# EAGLE design ICP_XMega (EAGLE 6.6.0)
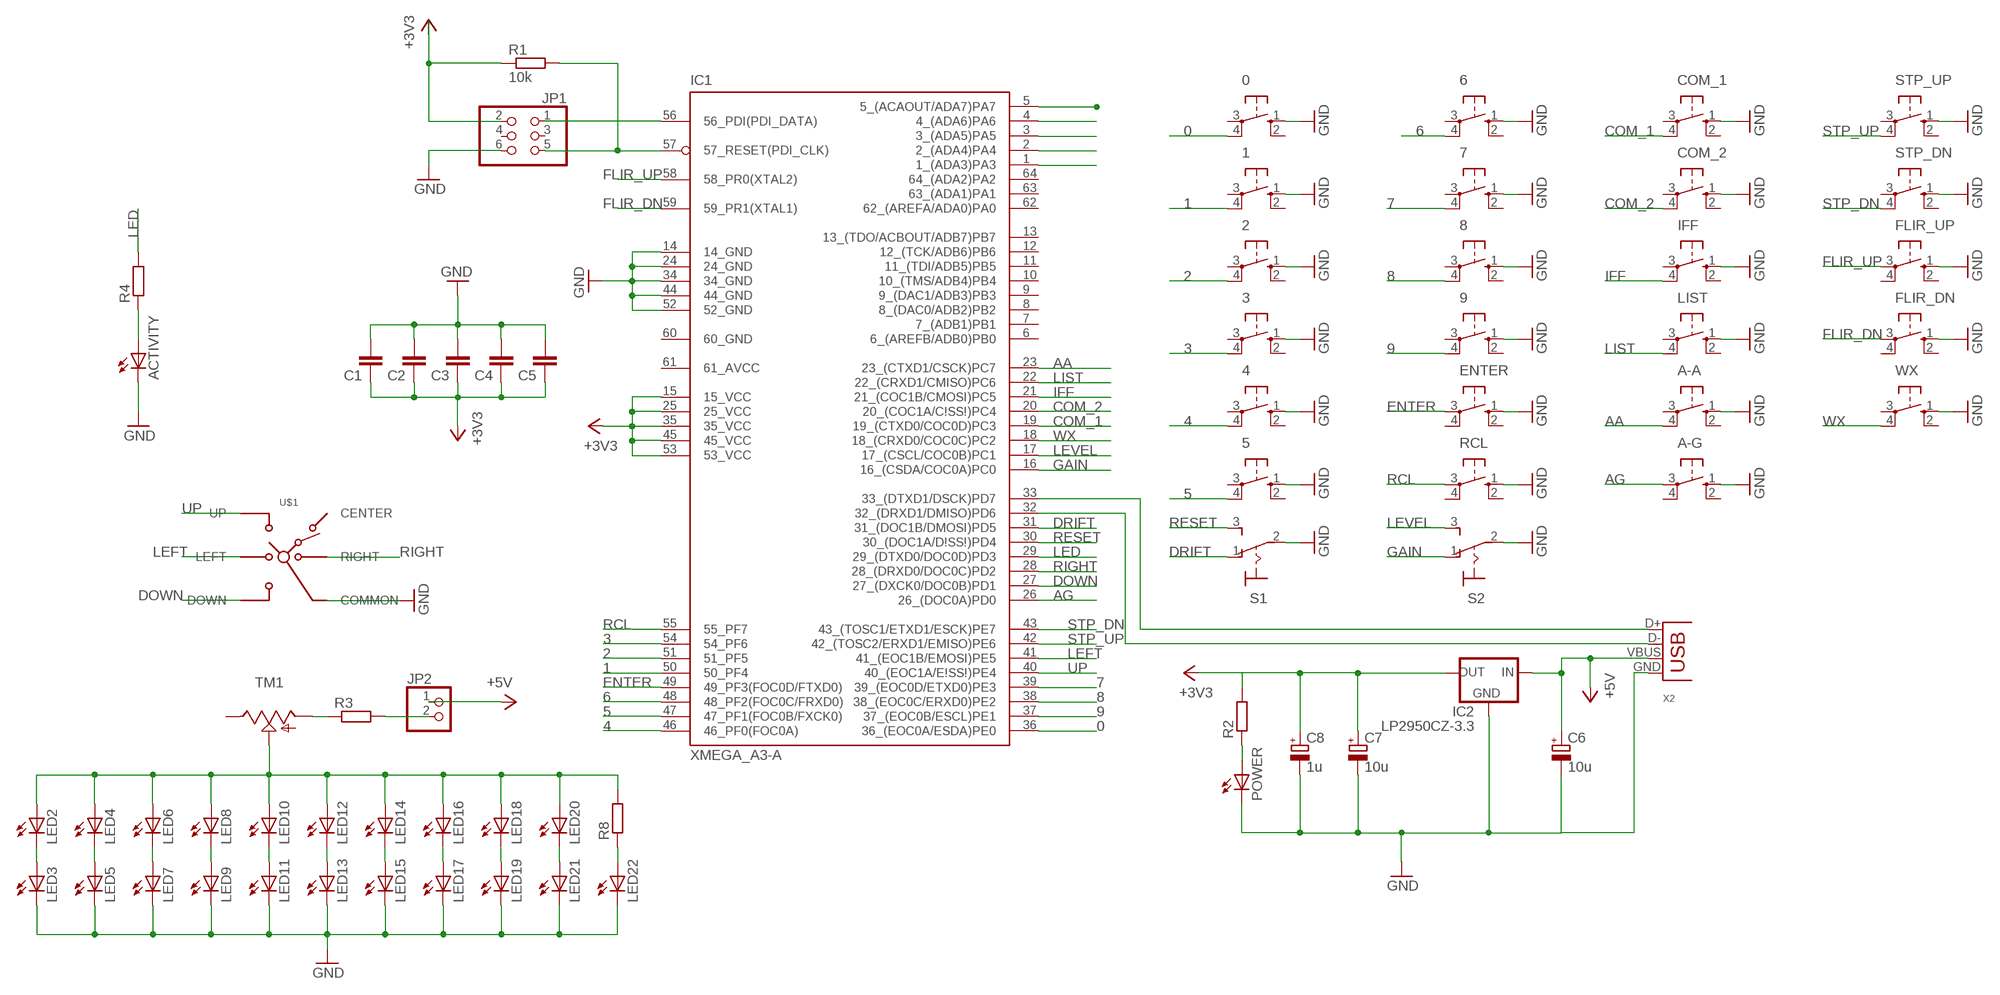
[diagram p0: schematic, sheet 1]

## Parts
0  10-XX  [B3F-10XX]
1  10-XX  [B3F-10XX]
2  10-XX  [B3F-10XX]
3  10-XX  [B3F-10XX]
4  10-XX  [B3F-10XX]
5  10-XX  [B3F-10XX]
6  10-XX  [B3F-10XX]
7  10-XX  [B3F-10XX]
8  10-XX  [B3F-10XX]
9  10-XX  [B3F-10XX]
A-A  10-XX  [B3F-10XX]
A-G  10-XX  [B3F-10XX]
ACTIVITY  LEDSMT1206  [1206]
C1  C-EUC1206  [C1206]
C2  C-EUC1206  [C1206]
C3  C-EUC1206  [C1206]
C4  C-EUC1206  [C1206]
C5  C-EUC1206  [C1206]
C6  10u  CPOL-EUE2.5-5  [E2,5-5]
C7  10u  CPOL-EUE2.5-5  [E2,5-5]
C8  1u  CPOL-EUC/6032-28R  [C/6032-28R]
COM_1  10-XX  [B3F-10XX]
COM_2  10-XX  [B3F-10XX]
ENTER  10-XX  [B3F-10XX]
FLIR_DN  10-XX  [B3F-10XX]
FLIR_UP  10-XX  [B3F-10XX]
IC1  XMEGA_A3-A  [TQFP64]
IC2  LP2950CZ-3.3  [TO92]
IFF  10-XX  [B3F-10XX]
JP1  PINHD-2X3  [2X03]
JP2  PINHD-1X2  [1X02]
LED2  LEDSMT1206  [1206]
LED3  LEDSMT1206  [1206]
LED4  LEDSMT1206  [1206]
LED5  LEDSMT1206  [1206]
LED6  LEDSMT1206  [1206]
LED7  LEDSMT1206  [1206]
LED8  LEDSMT1206  [1206]
LED9  LEDSMT1206  [1206]
LED10  LEDSMT1206  [1206]
LED11  LEDSMT1206  [1206]
LED12  LEDSMT1206  [1206]
LED13  LEDSMT1206  [1206]
LED14  LEDSMT1206  [1206]
LED15  LEDSMT1206  [1206]
LED16  LEDSMT1206  [1206]
LED17  LEDSMT1206  [1206]
LED18  LEDSMT1206  [1206]
LED19  LEDSMT1206  [1206]
LED20  LEDSMT1206  [1206]
LED21  LEDSMT1206  [1206]
LED22  LEDSMT1206  [1206]
LIST  10-XX  [B3F-10XX]
POWER  LEDSMT1206  [1206]
R1  10k  R-EU_R1206  [R1206]
R2  R-EU_M1206  [M1206]
R3  R-EU_0204/7  [0204/7]
R4  R-EU_M1206  [M1206]
R8  R-EU_M1206  [M1206]
RCL  10-XX  [B3F-10XX]
S1  320-916  [320-916]
S2  320-916  [320-916]
STP_DN  10-XX  [B3F-10XX]
STP_UP  10-XX  [B3F-10XX]
TM1  TRIM  [6MM]
U$1  SKQUCAA010  [SKQU]
WX  10-XX  [B3F-10XX]
X2  USB-B-H  [USB-B-H]

## Nets
0: 0.4(P1) IC1.36(36_(EOC0A/ESDA)PE0)
1: 1.4(P1) IC1.50(50_PF4)
2: 2.4(P1) IC1.51(51_PF5)
3: 3.4(P1) IC1.54(54_PF6)
4: 4.4(P1) IC1.46(46_PF0(FOC0A))
5: 5.4(P1) IC1.47(47_PF1(FOC0B/FXCK0))
6: 6.4(P1) IC1.48(48_PF2(FOC0C/FRXD0))
7: 7.4(P1) IC1.39(39_(EOC0D/ETXD0)PE3)
8: 8.4(P1) IC1.38(38_(EOC0C/ERXD0)PE2)
9: 9.4(P1) IC1.37(37_(EOC0B/ESCL)PE1)
+3V3: C1.1 C2.1 C3.1 C4.1 C5.1 C7.+ C8.+ IC1.15(15_VCC) IC1.25(25_VCC) IC1.35(35_VCC) IC1.45(45_VCC) IC1.53(53_VCC) IC2.1(OUT) JP1.2 R1.1 R2.2
+5V: C6.+ IC2.3(IN) JP2.1 X2.VBUS
AA: A-A.4(P1) IC1.23(23_(CTXD1/CSCK)PC7)
AG: A-G.3(P) IC1.26(26_(DOC0A)PD0)
COM_1: COM_1.4(P1) IC1.19(19_(CTXD0/COC0D)PC3)
COM_2: COM_2.4(P1) IC1.20(20_(COC1A/C\!SS\!)PC4)
DOWN: IC1.27(27_(DXCK0/DOC0B)PD1) U$1.DOWN
DRIFT: IC1.31(31_(DOC1B/DMOSI)PD5) S1.1(O)
ENTER: ENTER.3(P) IC1.49(49_PF3(FOC0D/FTXD0))
FLIR_DN: FLIR_DN.3(P) IC1.59(59_PR1(XTAL1))
FLIR_UP: FLIR_UP.3(P) IC1.58(58_PR0(XTAL2))
GAIN: IC1.16(16_(CSDA/COC0A)PC0) S2.1(O)
GND: 0.1(S) 1.1(S) 2.1(S) 3.1(S) 4.1(S) 5.1(S) 6.1(S) 7.1(S) 8.1(S) 9.1(S) A-A.1(S) A-G.1(S) ACTIVITY.C C1.2 C2.2 C3.2 C4.2 C5.2 C6.- C7.- C8.- COM_1.1(S) COM_2.1(S) ENTER.1(S) FLIR_DN.1(S) FLIR_UP.1(S) IC1.14(14_GND) IC1.24(24_GND) IC1.34(34_GND) IC1.44(44_GND) IC1.52(52_GND) IC2.2(GND) IFF.1(S) JP1.6 LED3.C LED5.C LED7.C LED9.C LED11.C LED13.C LED15.C LED17.C LED19.C LED21.C LED22.C LIST.1(S) POWER.C RCL.1(S) S1.2(P) S2.2(P) STP_DN.1(S) STP_UP.1(S) U$1.COMMON WX.1(S) X2.GND
IFF: IC1.21(21_(COC1B/CMOSI)PC5) IFF.4(P1)
LED: IC1.29(29_(DTXD0/DOC0D)PD3) R4.2
LEFT: IC1.41(41_(EOC1B/EMOSI)PE5) U$1.LEFT
LEVEL: IC1.17(17_(CSCL/COC0B)PC1) S2.3(S)
LIST: IC1.22(22_(CRXD1/CMISO)PC6) LIST.4(P1)
N$1: IC1.56(56_PDI(PDI_DATA)) JP1.1
N$2: IC1.57(57_RESET(PDI_CLK)) JP1.5 R1.2
N$3: IC1.33(33_(DTXD1/DSCK)PD7) X2.D+
N$4: LED22.A R8.1
N$5: IC1.32(32_(DRXD1/DMISO)PD6) X2.D-
N$6: POWER.A R2.1
N$7: LED18.C LED19.A
N$8: LED20.C LED21.A
N$9: LED16.C LED17.A
N$10: LED14.C LED15.A
N$11: LED12.C LED13.A
N$12: LED10.C LED11.A
N$13: LED8.C LED9.A
N$14: LED6.C LED7.A
N$15: LED4.C LED5.A
N$16: LED2.C LED3.A
N$17: R3.1 TM1.A
N$18: LED2.A LED4.A LED6.A LED8.A LED10.A LED12.A LED14.A LED16.A LED18.A LED20.A R8.2 TM1.S
N$19: JP2.2 R3.2
N$20: ACTIVITY.A R4.1
N$21: IC1.1(1_(ADA3)PA3)
N$22: IC1.2(2_(ADA4)PA4)
N$23: IC1.3(3_(ADA5)PA5)
N$24: IC1.4(4_(ADA6)PA6)
N$25: IC1.5(5_(ACAOUT/ADA7)PA7)
RCL: IC1.55(55_PF7) RCL.3(P)
RESET: IC1.30(30_(DOC1A/D\!SS\!)PD4) S1.3(S)
RIGHT: IC1.28(28_(DRXD0/DOC0C)PD2) U$1.RIGHT
STP_DN: IC1.43(43_(TOSC1/ETXD1/ESCK)PE7) STP_DN.4(P1)
STP_UP: IC1.42(42_(TOSC2/ERXD1/EMISO)PE6) STP_UP.4(P1)
UP: IC1.40(40_(EOC1A/E\!SS\!)PE4) U$1.UP
WX: IC1.18(18_(CRXD0/COC0C)PC2) WX.4(P1)
Unconnected: 0.2(S1) 0.3(P) 1.2(S1) 1.3(P) 2.2(S1) 2.3(P) 3.2(S1) 3.3(P) 4.2(S1) 4.3(P) 5.2(S1) 5.3(P) 6.2(S1) 6.3(P) 7.2(S1) 7.3(P) 8.2(S1) 8.3(P) 9.2(S1) 9.3(P) A-A.2(S1) A-A.3(P) A-G.2(S1) A-G.4(P1) COM_1.2(S1) COM_1.3(P) COM_2.2(S1) COM_2.3(P) ENTER.2(S1) ENTER.4(P1) FLIR_DN.2(S1) FLIR_DN.4(P1) FLIR_UP.2(S1) FLIR_UP.4(P1) IC1.6(6_(AREFB/ADB0)PB0) IC1.7(7_(ADB1)PB1) IC1.8(8_(DAC0/ADB2)PB2) IC1.9(9_(DAC1/ADB3)PB3) IC1.10(10_(TMS/ADB4)PB4) IC1.11(11_(TDI/ADB5)PB5) IC1.12(12_(TCK/ADB6)PB6) IC1.13(13_(TDO/ACBOUT/ADB7)PB7) IC1.60(60_GND) IC1.61(61_AVCC) IC1.62(62_(AREFA/ADA0)PA0) IC1.63(63_(ADA1)PA1) IC1.64(64_(ADA2)PA2) IFF.2(S1) IFF.3(P) JP1.3 JP1.4 LIST.2(S1) LIST.3(P) RCL.2(S1) RCL.4(P1) STP_DN.2(S1) STP_DN.3(P) STP_UP.2(S1) STP_UP.3(P) TM1.E U$1.CENTER WX.2(S1) WX.3(P)

## Library data of the parts
0 1-9 A-A A-G COM_1 COM_2 ENTER FLIR_DN FLIR_UP IFF LIST RCL STP_DN STP_UP WX = switch-omron:10-XX: OMRON SWITCH; MPN: B3F-1000; OC_FARNELL: 176432; OC_NEWARK: 36M3542
ACTIVITY LED2-LED22 POWER = led:LED: LED OSRAM: - CHIPLED LG R971, LG N971, LY N971, LG Q971, LY Q971, LO R971, LY R971 LH N974, LH R974 LS Q976, LO Q976, LY Q976 LO Q996 - Hyper CHIPLED LW Q18S LB Q993, LB Q99A, LB R99A - SideLED LS A670, LO A670, LY A670, LG A670, LP A670 LB A673, LV A673, LT A673, LW A673 LH A674 LY A675 LS A676, LA A676, LO A676, LY A676, LW A676 LS A679, LY A679, LG A679 - Hyper Micro SIDELED® LS Y876, LA Y876, LO Y876, LY Y876 LT Y87S - SmartLED LW L88C, LW L88S LB L89C, LB L89S, LG L890 LS L89K, LO L89K, LY L89K LS L896, LA L896, LO L896, LY L896 - TOPLED LS T670, LO T670, LY T670, LG T670, LP T670 LSG T670, LSP T670, LSY T670, LOP T670, LYG T670 LG T671, LOG T671, LSG T671 LB T673, LV T673, LT T673, LW T673 LH T674 LS T676, LA T676, LO T676, LY T676, LB T676, LH T676, LSB T676, LW T676 LB T67C, LV T67C, LT T67C, LS T67K, LO T67K, LY T67K, LW E67C LS E67B, LA E67B, LO E67B, LY E67B, LB E67C, LV E67C, LT E67C LW T67C LS T679, LY T679, LG T679 LS T770, LO T770, LY T770, LG T770, LP T770 LB T773, LV T773, LT T773, LW T773 LH T774 LS E675, LA E675, LY E675, LS T675 LS T776, LA T776, LO T776, LY T776, LB T776 LHGB T686 LT T68C, LB T68C - Hyper Mini TOPLED® LB M676 - Mini TOPLED Santana® LG M470 LS M47K, LO M47K, LY M47K Source: http://www.osram.convergy.de LUXEON: - LUMILED® LXK2-PW12-R00, LXK2-PW12-S00, LXK2-PW14-U00, LXK2-PW14-V00 LXK2-PM12-R00, LXK2-PM12-S00, LXK2-PM14-U00 LXK2-PE12-Q00, LXK2-PE12-R00, LXK2-PE12-S00, LXK2-PE14-T00, LXK2-PE14-U00 LXK2-PB12-K00, LXK2-PB12-L00, LXK2-PB12-M00, LXK2-PB14-N00, LXK2-PB14-P00, LXK2-PB14-Q00 LXK2-PR12-L00, LXK2-PR12-M00, LXK2-PR14-Q00, LXK2-PR14-R00 LXK2-PD12-Q00, LXK2-PD12-R00, LXK2-PD12-S00 LXK2-PH12-R00, LXK2-PH12-S00 LXK2-PL12-P00, LXK2-PL12-Q00, LXK2-PL12-R00 Source: www.luxeon.com KINGBRIGHT: KA-3528ASYC Source: www.kingbright.com
C1-C5 = resistor:C-EU: CAPACITOR, European symbol
C6-C8 = resistor:CPOL-EU: POLARIZED CAPACITOR, European symbol
IC1 = xmega_a3:XMEGA_A3: MICROCONTROLLER 64-256 Kbytes FLASH 4-16 Kbytes SRAM 2-4 Kbytes EEPROM DMA Controller and Event System 2 8-channel 12 bit ADC, 1 2-channel 12bit DAC 7 USART, 2 TWI, 3 SPI AES and DES Crypto Engine Source: xmega_a3.lbr
IC2 = v-reg:LP2950?*: Source: http://cache.national.com/ds/LP/LP2950.pdf
JP1 = pinhead:PINHD-2X3: PIN HEADER
JP2 = pinhead:PINHD-1X2: PIN HEADER
R1-R4 R8 = resistor:R-EU_: RESISTOR, European symbol
S1 S2 = switch:320-916: TOGGLE SWITCH distributor RS Components
TM1 = adafruit:TRIM
U$1 = gamaral:SKQU: Multi Control Devices TACT Switch - 4-directional with Center Push Type. SKQU Series.; MF: ALPS; OC_ADAFRUIT: 504; OC_MOUSER: 688-SKQUCA; OC_NEWARK: 59M1983
X2 = con-usb-3:USB: USB Connectors

## Board
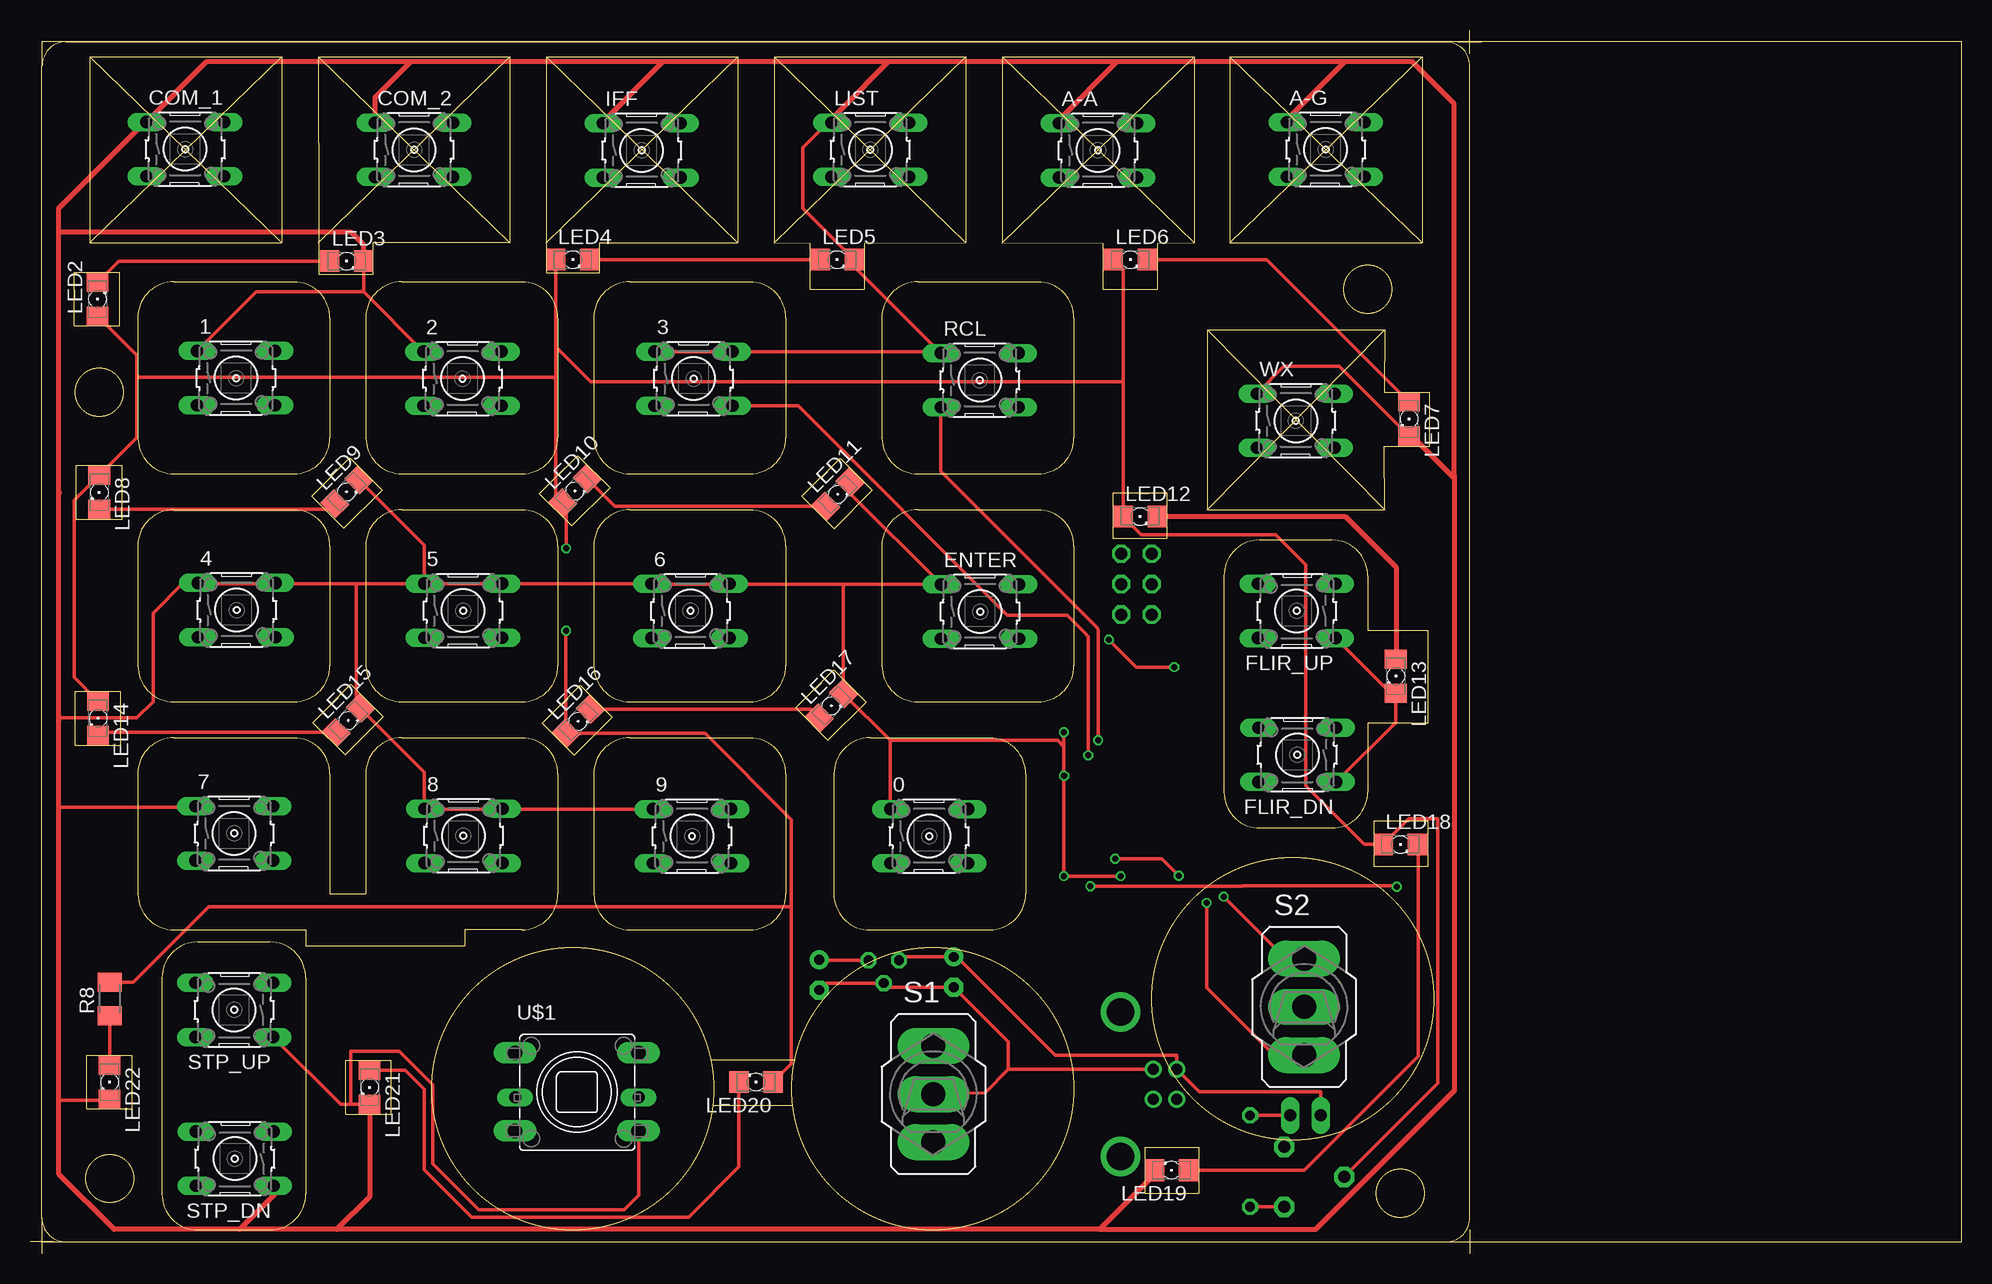
[diagram p1: board, top side]
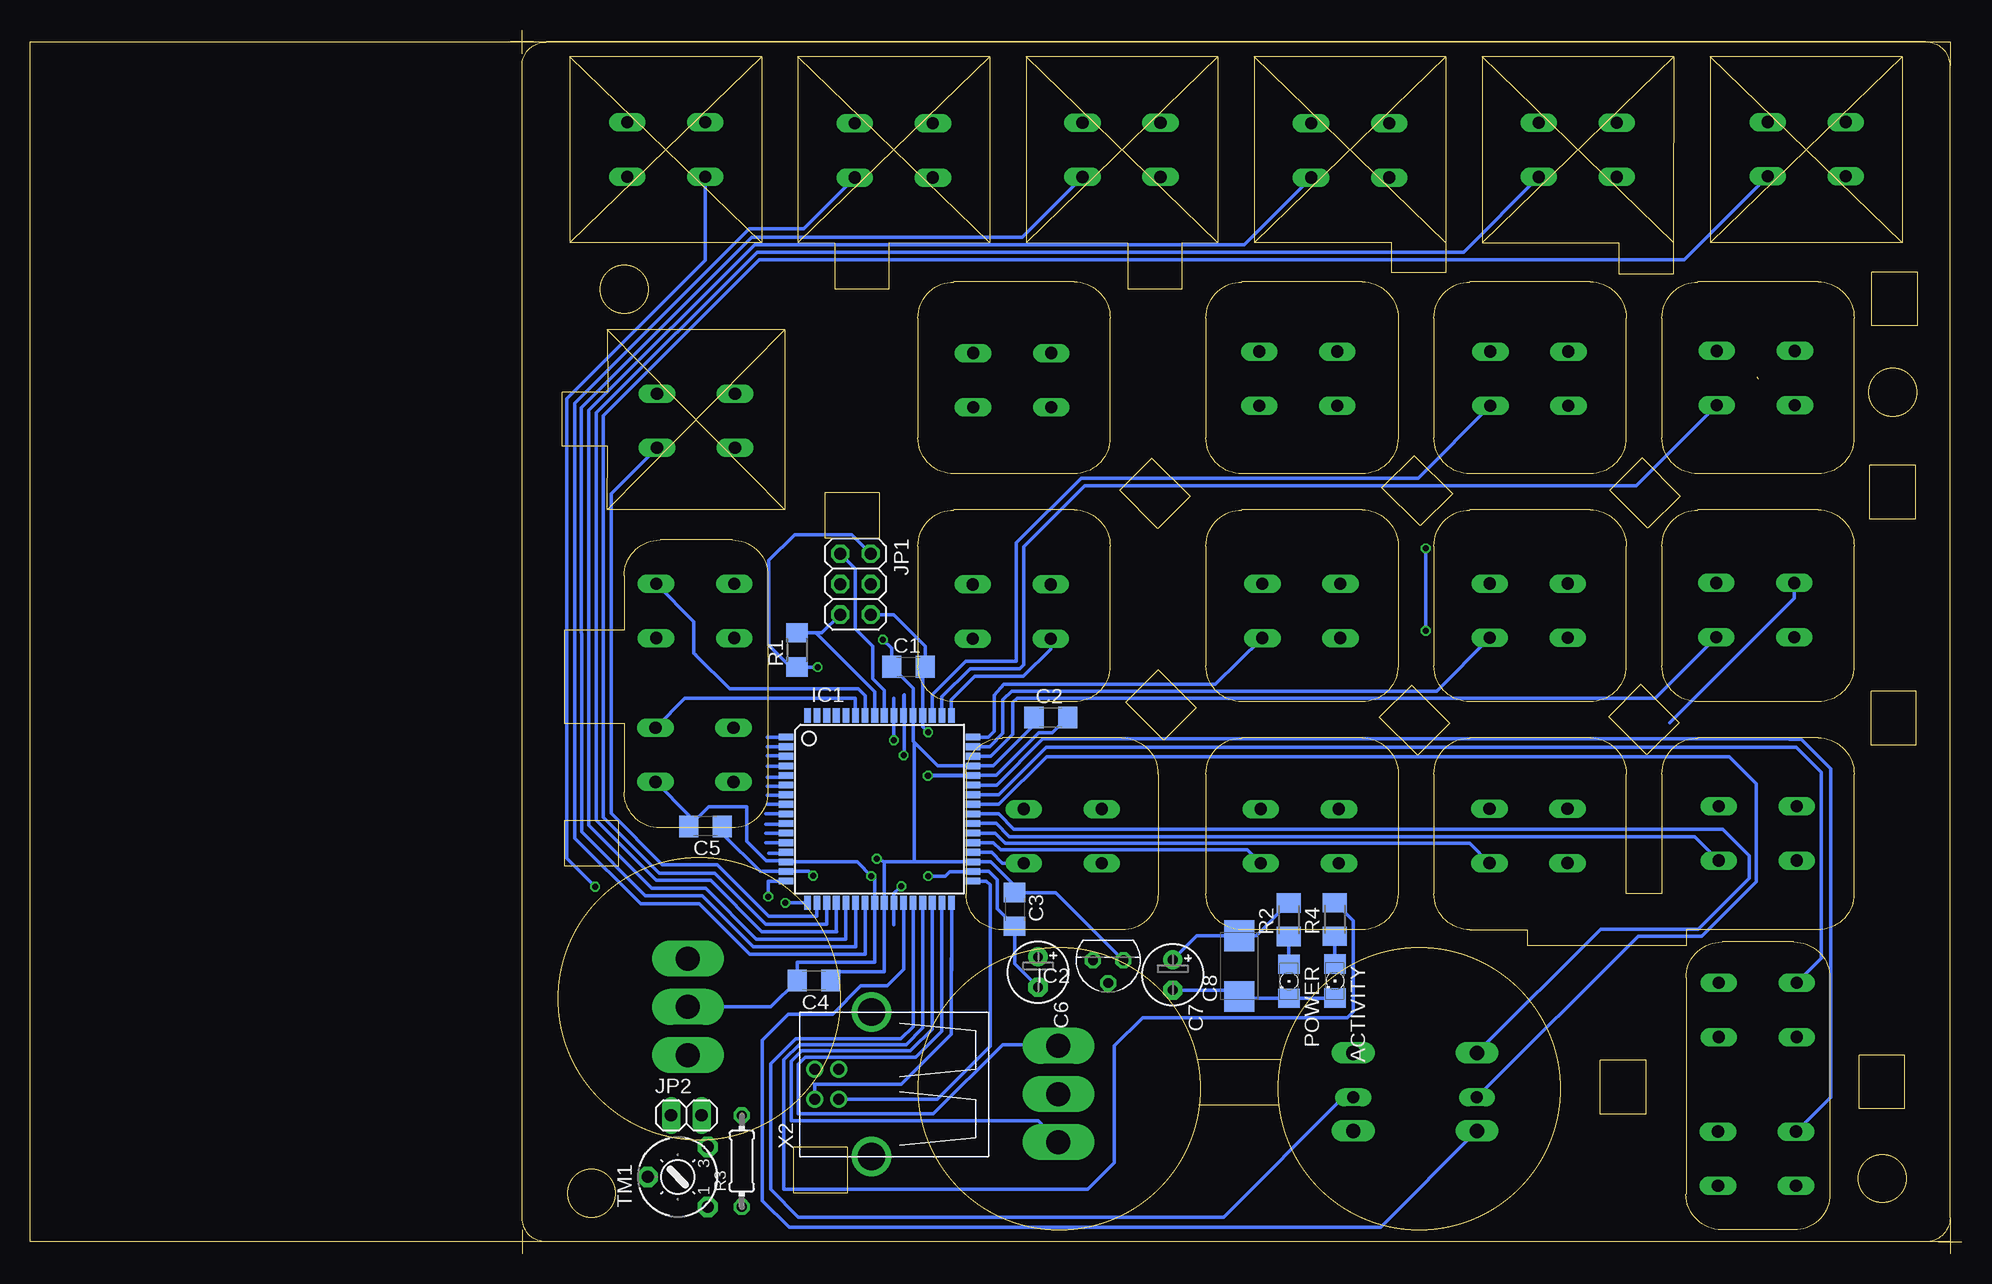
[diagram p2: board, bottom side, seen from below]

Size 160.99 x 101.98 mm. Coordinates in mm from the lower left corner, seen from the top.
Outline: 1.98,0.99 0.99,0.99 0.99,1.98
Outline: 1.98,0.99 3,0.99 117.98,0.99
Outline: 117.98,0.99 119,0.99 120.98,0.99 160.99,0.99 160.99,100.99 0.99,100.99 0.99,98.98 0.99,3
Outline: 0.99,3 0.99,1.98
Outline: 0.99,3 arc90 3,1
Outline: 117.98,0.99 arc90 119.98,3
Outline: 117.98,100.98 arc-90 119.99,98.98 119.99,3
Outline: 1,98.98 arc-90 3,100.99 117.98,100.99
Outline: 41,80.98 arc-90 43.99,77.98 43.99,68 arc-90 41,65 30.99,65 arc-90 27.99,68 27.99,77.98
Outline: 27.98,77.98 arc-90 30.99,81 41,81
Outline: 22,80.98 arc-90 24.99,77.98 24.99,68 arc-90 22,65 11.99,65 arc-90 8.99,68 8.99,77.98
Outline: 8.98,77.98 arc-90 11.99,81 22,81
Outline: 59.99,80.98 arc-90 62.99,77.98 62.99,68 arc-90 59.99,65 49.99,65 arc-90 46.99,68 46.99,77.98
Outline: 46.98,77.98 arc-90 49.99,81 59.99,81
Outline: 41,61.98 arc-90 43.99,58.98 43.99,49 arc-90 41,46 30.99,46 arc-90 27.99,49 27.99,58.98
Outline: 27.98,58.98 arc-90 30.99,62 41,62
Outline: 59.99,61.98 arc-90 62.99,58.98 62.99,49 arc-90 59.99,46 49.99,46 arc-90 46.99,49 46.99,58.98
Outline: 46.98,58.98 arc-90 49.99,62 59.99,62
Outline: 41,42.98 arc-90 43.99,39.98 43.99,30 arc-90 41,27 36.22,27 36.22,25.68 22.99,25.68 22.99,27 11.99,27 arc-90 8.99,30 8.99,39.98
Outline: 27.98,39.98 arc-90 30.99,43 41,43
Outline: 59.99,42.98 arc-90 62.99,39.98 62.99,30 arc-90 59.99,27 49.99,27 arc-90 46.99,30 46.99,39.98
Outline: 46.98,39.98 arc-90 49.99,43 59.99,43
Outline: 22,61.98 arc-90 24.99,58.98 24.99,49 arc-90 22,46 11.99,46 arc-90 8.99,49 8.99,58.98
Outline: 8.98,58.98 arc-90 11.99,62 22,62
Outline: 22,42.98 arc-90 24.99,39.98 24.99,30 27.99,30 27.99,39.98
Outline: 8.98,39.98 arc-90 11.99,43 22,43
Outline: 84,80.98 arc-90 86.99,77.98 86.99,68 arc-90 84,65 73.99,65 arc-90 70.99,68 70.99,77.98
Outline: 70.98,77.98 arc-90 73.99,81 84,81
Outline: 84,61.98 arc-90 86.99,58.98 86.99,49 arc-90 84,46 73.99,46 arc-90 70.99,49 70.99,58.98
Outline: 70.98,58.98 arc-90 73.99,62 84,62
Outline: 79.98,42.98 arc-90 82.98,39.98 82.98,30 arc-90 79.98,27 70,27
Outline: 70,26.99 arc-90 66.98,30 66.98,39.98
Outline: 66.99,39.98 arc-90 70,43 79.98,43
Outline: 23,4.98 arc-90 19.99,1.98 14,1.98 arc-90 11,4.98 11,22.99 arc-90 14,25.98 19.99,25.98 arc-90 22.99,22.99 22.99,4.98
Outline: 39.98,84.25 28.57,84.25 28.57,81.61 24.05,81.61 24.05,85.39 24,99.75
Outline: 58.98,84.25 47.5,84.25 47.5,81.76 43,81.76 43,84.25
Outline: 62,84.25 65,84.2 65,80.39 69.52,80.39 69.52,84.2 77.98,84.25
Outline: 81,84.25 89.41,84.2 89.41,80.39 93.93,80.39 93.93,84.2 97,84.25
Outline: 112.88,76.99 112.85,71.81 116.64,71.81 116.64,67.31 112.85,67.31 112.88,62
Outline: 43,99.75 43,84.25
Outline: 4.98,99.75 20.98,99.75
Outline: 4.98,99.75 4.98,84.25
Outline: 4.98,84.25 20.98,84.25
Outline: 20.98,99.75 20.98,84.25
Outline: 4.98,99.75 20.98,84.25
Outline: 4.98,84.25 20.98,99.75
Outline: 24,99.75 39.98,99.75
Outline: 39.98,99.75 39.98,84.25
Outline: 24,99.75 39.98,84.25
Outline: 24,84.25 39.98,99.75
Outline: 43,99.75 58.98,99.75
Outline: 58.98,99.75 58.98,84.25
Outline: 43,99.75 58.98,84.25
Outline: 43,84.25 58.98,99.75
Outline: 62,99.75 77.98,99.75
Outline: 62,99.75 62,84.25
Outline: 77.98,99.75 77.98,84.25
Outline: 62,99.75 77.98,84.25
Outline: 62,84.25 77.98,99.75
Outline: 81,99.75 97,99.75
Outline: 81,99.75 81,84.25
Outline: 97,99.75 97,84.25
Outline: 81,99.75 97,84.25
Outline: 81,84.25 97,99.75
Outline: 100,99.75 116,99.75
Outline: 100,99.75 100,84.25
Outline: 100,84.25 116,84.25
Outline: 116,99.75 116,84.25
Outline: 100,99.75 116,84.25
Outline: 100,84.25 116,99.75
Outline: 98.09,76.99 112.88,76.99
Outline: 98.09,76.99 98.09,62
Outline: 98.09,62 112.88,62
Outline: 98.09,76.99 112.88,62
Outline: 98.09,62 112.88,76.99
Outline: 56.74,16.18 63.75,16.18
Outline: 56.92,12.37 63.58,12.37
Outline: 1.98,0.99 0,0.99
Outline: 0.99,1.98 0.99,0
Outline: 119.99,1.98 119.99,0
Outline: 119,100.99 120.98,100.99
Outline: 119.99,100 119.99,101.98
Outline: 16.99,72.97 16.97,72.92 17.04,73.05 17.04,73
Outline: 111.48,56.49 arc90 108.48,59.49 102.49,59.49 arc90 99.49,56.49 99.49,38.48 arc90 102.49,35.48 108.48,35.48 arc90 111.48,38.48 111.48,44.2 116.46,44.2 116.46,51.97 111.48,51.97 111.48,56.49
Outline: 42.44,63.35 45.64,66.52 48.34,63.83 45.14,60.66 42.44,63.35
Outline: 23.57,44.25 26.75,47.45 29.44,44.75 26.26,41.58 23.57,44.25
Outline: 23.47,63.14 26.64,66.32 29.34,63.63 26.16,60.45 23.47,63.14
Outline: 42.67,44.2 45.85,47.4 48.54,44.7 45.34,41.53 42.67,44.2
Outline: 64.31,63.12 67.51,66.29 70.18,63.63 67.01,60.43 64.31,63.12
Outline: 63.8,45.49 66.98,48.67 69.67,45.97 66.5,42.8 63.8,45.49
Outline: 26.31,11.63 26.31,16.13 30.12,16.13 30.12,11.63 26.31,11.63
Outline: 3.68,77.32 3.68,81.81 7.49,81.81 7.49,77.32 3.68,77.32
Outline: 3.86,61.21 3.86,65.71 7.67,65.71 7.67,61.21 3.86,61.21
Outline: 3.78,42.37 3.78,46.86 7.57,46.86 7.57,42.37 3.78,42.37
Outline: 4.75,12.06 4.75,16.56 8.53,16.56 8.53,12.06 4.75,12.06
Outline: 90.22,63.42 94.74,63.42 94.74,59.61 90.22,59.61 90.22,63.42
Outline: 92.89,8.86 97.38,8.86 97.38,5.05 92.89,5.05 92.89,8.86
Outline: 111.96,36.09 116.46,36.09 116.46,32.28 111.96,32.28 111.96,36.09
Outline: circle at 114.2,5.05 radius 2.01
Outline: circle at 6.63,6.27 radius 2.01
Outline: circle at 111.48,80.39 radius 2.01
Outline: circle at 5.77,71.81 radius 2.01
Outline: circle at 105.23,21.23 radius 11.76
Outline: circle at 75.23,13.74 radius 11.76
Outline: circle at 45.24,13.74 radius 11.76
Copper layers (1*16): Top 0.035mm / dielectric 1.5mm / Bottom 0.035mm
Design rules "ITEADstudio_DRC": minimum track width 6mil, minimum drill 12mil, track to track 6mil, track to pad 6mil, pad to pad 6mil, via to via 6mil, smd to smd 0mil, copper to edge 10mil, drill to drill 10mil, minimum pad ring 10mil, minimum via ring 6mil, stop-mask expansion 2mil, vias tented up to drill 100mil, thermal gap 10mil

### Footprints (pad centres in the part's own frame; a part is rotated, then mirrored left to right if it is on the bottom)
B3F-10XX = drill 1.016 long: 1 -3.251,2.261; 2 3.251,2.261; 3 -3.251,-2.261; 4 3.251,-2.261
1206 = smd 1.6 x 1.803: A -1.422,0; C 1.422,0
C1206 = smd 1.6 x 1.8: 1 -1.4,0; 2 1.4,0
E2,5-5 = drill 0.813 pad 1.6: + -1.27,0 | drill 0.813 pad 1.6 octagon: - 1.27,0
C/6032-28R = smd 2.55 x 2.5: + 2.525,0; - -2.525,0
TQFP64 = smd 1.194 x 0.559: 1 -7.8,6; 2 -7.8,5.2; 3 -7.8,4.4; 4 -7.8,3.6; 5 -7.8,2.8; 6 -7.8,2; 7 -7.8,1.2; 8 -7.8,0.4; 9 -7.8,-0.4; 10 -7.8,-1.2; 11 -7.8,-2; 12 -7.8,-2.8; 13 -7.8,-3.6; 14 -7.8,-4.4; 15 -7.8,-5.2; 16 -7.8,-6; 33 7.8,-6; 34 7.8,-5.2; 35 7.8,-4.4; 36 7.8,-3.6; 37 7.8,-2.8; 38 7.8,-2; 39 7.8,-1.2; 40 7.8,-0.4; 41 7.8,0.4; 42 7.8,1.2; 43 7.8,2; 44 7.8,2.8; 45 7.8,3.6; 46 7.8,4.4; 47 7.8,5.2; 48 7.8,6 | smd 0.559 x 1.194: 17 -6,-7.8; 18 -5.2,-7.8; 19 -4.4,-7.8; 20 -3.6,-7.8; 21 -2.8,-7.8; 22 -2,-7.8; 23 -1.2,-7.8; 24 -0.4,-7.8; 25 0.4,-7.8; 26 1.2,-7.8; 27 2,-7.8; 28 2.8,-7.8; 29 3.6,-7.8; 30 4.4,-7.8; 31 5.2,-7.8; 32 6,-7.8; 49 6,7.8; 50 5.2,7.8; 51 4.4,7.8; 52 3.6,7.8; 53 2.8,7.8; 54 2,7.8; 55 1.2,7.8; 56 0.4,7.8; 57 -0.4,7.8; 58 -1.2,7.8; 59 -2,7.8; 60 -2.8,7.8; 61 -3.6,7.8; 62 -4.4,7.8; 63 -5.2,7.8; 64 -6,7.8
TO92 = drill 0.813 octagon: 1 -1.27,0; 2 0,1.905; 3 1.27,0
2X03 = drill 1.016 octagon: 1 -2.54,-1.27; 2 -2.54,1.27; 3 0,-1.27; 4 0,1.27; 5 2.54,-1.27; 6 2.54,1.27
1X02 = drill 1.016 long: 1 -1.27,0; 2 1.27,0
R1206 = smd 1.6 x 1.803: 1 -1.422,0; 2 1.422,0
M1206 = smd 1.6 x 2: 1 -1.4,0; 2 1.4,0
0204/7 = drill 0.813 octagon: 1 -3.81,0; 2 3.81,0
320-916 = drill 2.007 long: 1 0,4.013; 2 0,0; 3 0,-4.013
6MM = drill 1 pad 1.676 octagon: A -2.5,-2.5; E 2.5,-2.5; S 0,2.5
SKQU = drill 1.2 long: CENTER 5.15,3.25; COMMON 5.15,-3.25; DOWN -5.15,-3.25; UP -5.15,3.25 | drill 1 long: LEFT -5.15,-0.45; RIGHT 5.15,-0.45
USB-B-H = drill 0.914: D+ 0,1.25; D- 1.981,1.25; GND 0,-1.25; VBUS 1.981,-1.25 | drill 2.286: P$1 -2.718,-6.02; P$2 -2.718,6.02

### Placement (x,y rotation side)
0  74.93,34.8 0 top
1  17.17,72.97 0 top
2  36.04,72.92 0 top
3  55.3,72.92 0 top
4  17.22,53.64 0 top
5  36.09,53.59 0 top
6  55.04,53.57 0 top
7  17.02,35.03 0 top
8  36.12,34.82 0 top
9  55.17,34.8 0 top
A-A  89,91.95 0 top
A-G  107.98,92.02 0 top
ACTIVITY  52.25,22.73 270 bottom
C1  87.78,48.92 0 bottom
C2  75.92,44.7 0 bottom
C3  78.94,28.7 270 bottom
C4  95.66,22.76 180 bottom
C5  104.7,35.61 180 bottom
C6  76.99,23.47 270 bottom
C7  65.76,23.24 270 bottom
C8  60.22,23.98 90 bottom
COM_1  12.93,92.05 0 top
COM_2  32,92 0 top
ENTER  79.17,53.52 0 top
FLIR_DN  105.61,41.58 180 top
FLIR_UP  105.56,53.57 180 top
IC1  90.2,37.06 0 bottom
IC2  71.15,24.46 180 bottom
IFF  50.98,91.95 0 top
JP1  92.2,55.8 270 bottom
JP2  106.3,11.53 0 bottom
LED2  5.64,79.55 90 top
LED3  26.39,82.73 0 top
LED4  45.24,82.85 0 top
LED5  67.26,82.85 0 top
LED6  91.69,82.85 0 top
LED7  114.91,69.57 270 top
LED8  5.77,63.45 270 top
LED9  26.39,63.5 45 top
LED10  45.42,63.58 45 top
LED11  67.31,63.3 45 top
LED12  92.51,61.44 0 top
LED13  113.82,48.13 270 top
LED14  5.66,44.63 270 top
LED15  26.52,44.45 45 top
LED16  45.67,44.37 45 top
LED17  66.78,45.67 45 top
LED18  114.2,34.11 0 top
LED19  95.12,6.96 180 top
LED20  60.5,14.3 180 top
LED21  28.3,13.87 270 top
LED22  6.63,14.3 270 top
LIST  70.03,92 0 top
POWER  56.08,22.71 270 bottom
R1  97.08,50.32 90 bottom
R2  56.08,27.84 90 bottom
R3  101.68,7.72 90 bottom
R4  52.25,27.86 90 bottom
R8  6.63,21.23 90 top
RCL  79.15,72.8 0 top
S1  75.29,13.31 0 top
S2  106.17,20.57 0 top
STP_DN  17.07,7.92 180 top
STP_UP  17.02,20.32 180 top
TM1  107.01,6.4 90 bottom
U$1  45.57,13.49 0 top
WX  105.49,69.42 0 top
X2  93.6,14.12 180 bottom

### Tracks (layer width: path | path; a pad name or v marks a point on that pad's centre or on a via)
0
  Bottom 0.305: IC1.36 80.85,33.46 79.96,32.56 78.21,32.56 0.4
1
  Bottom 0.305: IC1.50 85,46.4 82.63,48.77 78.51,48.77 78.18,49.1 78.18,58.9 73.1,63.98 27.15,63.98 1.4
2
  Bottom 0.305: 2.4 45.31,64.64 73.41,64.64 78.79,59.26 78.79,49.38 83.01,49.38 85.8,46.58 85.8,44.86 IC1.51
3  (via drill 0.5 pad 0.25)
  Top 0.305: v88.19,41.53 88.19,51.43 88.04,51.59 88.04,51.61 86.44,53.21 81.46,53.21 64.01,70.66 3.4
  Bottom 0.305: IC1.54 88.2,46.53 88.14,46.58 88.14,41.58 v88.19,41.53
4
  Bottom 0.305: IC1.46 80.92,41.46 79.1,43.28 79.1,45.95 78.74,46.3 25.55,46.3 4.4
5
  Bottom 0.305: IC1.47 81.01,42.26 79.91,43.36 79.91,46.18 79.17,46.86 43.76,46.86 5.4
6
  Bottom 0.305: IC1.48 81.12,43.06 80.64,43.54 80.64,46.56 79.83,47.45 62.23,47.45 6.4
7
  Bottom 0.305: IC1.39 80.46,35.86 79.37,34.77 22.28,34.77 7.4
8
  Bottom 0.305: IC1.38 80.55,35.06 79.71,34.21 41.02,34.21 8.4
9
  Bottom 0.305: IC1.37 80.72,34.26 80.11,33.65 59.54,33.65 9.4
+3V3  (via drill 0.5 pad 0.25)
  Top 0.305: C7.+ 65.81,24.46 IC2.1 | v95.35,48.89 92.2,48.89 v89.92,51.18 | v90.42,32.92 94.31,32.92 v95.73,31.5
  Bottom 0.305: C8.+ 59.95,25.43 | IC2.1 75.52,30.1 C3.1 79.07,30.23 79.07,30.78 80.94,32.66 IC1.35 82.4,32.66 87.3,32.66 | JP1.2 92.51,59.92 97.28,59.92 99.42,57.78 99.42,50.7 97.61,48.9 R1.1 v95.35,48.9 v95.35,48.89 | 87.3,42.62 87.38,42.7 87.38,44.84 IC1.53 87.4,47.13 C1.1 89.18,50.45 v89.92,51.18 | v95.73,31.5 96.1,31.86 IC1.15 100.13,31.86 103.25,34.98 103.25,35.56 C5.1 | 90.3,32.92 v90.42,32.92 89.8,32.66 | 87.3,42.62 85.34,40.66 IC1.45 80.7,40.66 77.42,43.94 77.42,44.61 C2.1 | 87.3,42.62 87.3,32.66 | C4.1 93.49,23.52 89.79,23.52 89.8,23.53 IC1.25 89.8,32.66 | 89.8,32.66 87.3,32.66 | C8.+ 63.77,26.5 C7.+ | C8.+ 58.82,26.5 R2.2
+5V
  Top 0.305: IC2.3 72.69,24.74 C6.+ 77.24,24.74 85.45,16.54 95.58,16.54 X2.VBUS 97.44,13.51 107.57,13.51 JP2.1
AA
  Bottom 0.305: IC1.23 91.4,24.94 101.02,24.94 105.23,29.16 110.11,29.16 115.6,34.65 115.6,70.87 101.04,85.42 96.52,85.42 A-A.4
AG  (via drill 0.5 pad 0.25)
  Top 0.305: v88.37,30.63 101.04,30.63 101.07,30.66 113.82,30.66 v113.89,30.58
  Bottom 0.305: IC1.26 | IC1.26 89,27.43 | IC1.26 89,30.02 88.57,30.45 88.54,30.45 v88.37,30.63 | v113.89,30.58 116.26,32.94 116.26,71.27 104.72,82.8 A-G.3
COM_1
  Bottom 0.305: IC1.19 94.6,27.46 99.67,27.46 103.91,31.7 108.53,31.7 113.21,36.37 113.21,69.85 100.23,82.83 23.14,82.83 COM_1.4
COM_2
  Bottom 0.305: COM_2.4 41.53,83.46 100.41,83.46 113.79,70.08 113.79,36.12 108.79,31.11 104.27,31.11 100,26.85 93.78,26.85 93.8,26.87 IC1.20
DOWN
  Bottom 0.305: IC1.27 88.2,23.69 89.56,22.33 91.74,22.33 94.11,19.96 97.79,19.96 99.95,17.81 99.95,4.42 97.74,2.21 48.45,2.21 U$1.DOWN
DRIFT
  Bottom 0.305: IC1.31 85,18.53 87.17,16.36 96.39,16.36 96.95,15.8 96.95,11.66 85.7,11.66 79.93,17.42 75.31,17.42 S1.1
ENTER
  Bottom 0.305: IC1.49 84.2,46.15 82.25,48.11 78.21,48.11 75.92,50.39 ENTER.3
FLIR_DN
  Bottom 0.305: IC1.59 92.2,46.28 106.43,46.28 FLIR_DN.3
FLIR_UP
  Bottom 0.305: IC1.58 91.4,46.49 91.97,47.07 102.69,47.07 105.51,49.89 105.51,49.91 105.66,50.06 105.66,52.68 FLIR_UP.3
GAIN  (via drill 0.5 pad 0.25)
  Top 0.305: v99.47,29.77 104.65,24.59 S2.1
  Bottom 0.305: IC1.16 99.47,31.06 v99.47,29.77
GND  (via drill 0.5 pad 0.25)
  Top 0.305: 2.54,63.47 2.41,63.35 | 5.1 27.2,55.85 | 27.2,55.85 14.02,55.85 4.1 12.78,55.91 10.26,53.39 10.26,46 8.92,44.65 2.57,44.65 2.41,44.5 | 5.1 32.87,55.83 6.1 51.84,55.78 67.69,55.78 | 67.69,55.78 ENTER.1 68.32,63.38 LED11.C | LED9.C 32.84,59.06 5.1 | 27.2,55.85 27.2,45.78 LED15.C 32.87,40.11 8.1 32.89,37.06 9.1 | STP_UP.1 25.88,12.45 26.75,12.45 | 26.75,12.45 LED21.C | FLIR_DN.1 113.82,44.27 113.82,46.3 | 113.82,46.3 LED13.C | FLIR_UP.1 113.82,46.3 | 2.1 27.81,80.16 | 27.81,80.16 LED3.C | 1.1 18.85,80.16 27.81,80.16 | 67.63,95.41 64.39,92.18 64.39,87.15 LED5.C 68.68,82.27 RCL.1 74.83,75.18 3.1 | 67.69,55.78 67.78,55.69 LED17.C 71.68,42.78 | 71.68,42.78 0.1 | 7.1 13.69,37.21 2.41,37.21 | LED22.C 6.55,12.8 2.41,12.8 | C7.- 66.34,22.56 IC2.2 71.5,22.2 C6.- 81.53,17.66 81.53,15.37 | v86.16,43.46 86.16,42.27 | 86.16,42.27 v86.16,39.85 | v86.16,39.85 v86.18,39.83 | v86.16,39.85 v86.16,31.47 v90.88,31.47 | LED7.C 109.12,73.94 104.5,73.94 WX.1 | 81.53,15.37 79.59,13.44 S1.2 | X2.GND 81.53,15.37 | U$1.COMMON 50.72,4.9 49.5,3.68 37.41,3.68 33.58,7.52 33.58,14.07 30.78,16.87 26.75,16.87 26.72,16.84 26.72,12.47 26.75,12.45 | 71.68,42.78 85.64,42.78 86.16,42.27
  Top 0.406: COM_1.1 14.73,99.36 31.75,99.36 | 31.75,99.36 52.78,99.36 | 52.78,99.36 71.58,99.36 | 71.58,99.36 90.6,99.36 | 90.6,99.36 109.6,99.36 | 109.6,99.36 115.16,99.36 118.64,95.88 118.64,64.95 | 118.64,64.95 118.64,64.67 115.16,68.15 LED7.C | 89.13,2.03 25.58,2.03 | 25.58,2.03 17.48,2.03 | 17.48,2.03 7.01,2.03 2.41,6.63 2.41,12.8 2.41,37.21 2.41,44.5 2.41,63.35 2.41,85.01 | 2.41,85.01 2.41,87.15 9.68,94.41 | COM_2.1 28.75,96.37 31.75,99.36 | IFF.1 47.73,94.31 52.78,99.36 | LIST.1 66.78,94.56 67.63,95.41 71.58,99.36 | A-A.1 85.75,94.51 90.6,99.36 | A-G.1 104.72,94.49 109.6,99.36 | LED3.C 27.81,84.07 26.77,85.12 2.51,85.12 2.41,85.01 | LED19.C 93.7,6.6 89.13,2.03 | LED21.C 28.3,4.75 25.58,2.03 | STP_DN.1 20.32,4.88 17.48,2.03 | 89.13,2.03 107.14,2.03 118.72,13.61 118.72,64.87 118.64,64.95
  Bottom 0.305: C6.- 78.94,24.16 C3.2 80.39,28.75 80.39,31.17 81.08,31.86 IC1.34 82.4,31.85 84.35,31.85 84.73,31.47 v86.16,31.47 | JP1.6 89,53.26 86.38,50.64 C1.2 86.6,48.71 IC1.52 86.6,43.9 v86.16,43.46 | 90.6,31.45 v90.88,31.47 | v86.18,39.83 82.43,39.83 IC1.44 | IC1.44 v86.15,39.86 v86.16,39.85 | 24.33,44.27 13.97,54.64 4.1 | 74.09,44.27 C2.2 75.82,43.41 76.94,43.41 80.49,39.86 IC1.44 | FLIR_DN.1 106.1,36.55 C5.2 104.45,37.26 101.27,37.26 101.27,34.37 99.64,32.74 98.08,32.74 IC1.14 92.07,32.66 v90.88,31.47 | v90.88,31.47 90.6,31.19 90.6,29.26 IC1.24 90.6,24.28 97.05,24.28 C4.2 99.24,20.57 S2.2 | C7.- 60.74,21.97 C8.- 60.06,21.29 POWER.C 56.06,21.31 ACTIVITY.C
IFF
  Bottom 0.305: IC1.21 93,26.21 100.46,26.21 104.7,30.45 109.17,30.45 114.43,35.71 114.43,70.28 100.61,84.1 59.82,84.1 IFF.4
LED
  Bottom 0.305: R4.2 50.72,27.74 50.72,20.17 51.21,19.68 68.28,19.68 70.64,17.32 70.64,7.59 72.85,5.38 98.17,5.38 98.17,16.15 96.9,17.42 87.99,17.42 86.6,18.81 IC1.29
LEFT
  Bottom 0.305: U$1.LEFT 26.99,26.47 21.67,26.47 17.14,30.99 17.14,39.17 19.41,41.43 76.28,41.43 80.24,37.46 IC1.41
LEVEL  (via drill 0.5 pad 0.25)
  Top 0.305: v98.04,29.24 98.04,22.17 103.63,16.59 105.38,16.59 S2.3
  Bottom 0.305: IC1.17 96.22,29.24 v98.04,29.24
LIST
  Bottom 0.305: LIST.4 78.31,84.71 100.84,84.71 115.06,70.48 115.06,51.74 115.01,51.69 115.01,35.15 109.7,29.84 104.98,29.84 100.71,25.58 93.93,25.58 93.01,25.58 92.18,25.58 92.18,29.24 IC1.22
N$1
  Bottom 0.305: JP1.1 92.2,57.07 92.2,52.07 90.78,50.65 90.78,47.93 89.8,46.95 IC1.56
N$2
  Bottom 0.305: R1.2 95.5,51.74 | 95.5,51.74 95,51.74 JP1.5 | IC1.57 90.6,46.83 95.5,51.74
N$3
  Bottom 0.305: IC1.33 81.3,31.06 80.98,30.73 80.98,17.3 85.4,12.87 X2.D+
N$4
  Top 0.305: LED22.A R8.1
N$5
  Bottom 0.305: IC1.32 84.2,24.64 | 84.2,24.64 84.2,23.63 | 84.2,24.64 84.2,24.63 84.2,18.31 88.39,14.12 95.66,14.12 95.58,14.05 X2.D-
N$6
  Bottom 0.305: R2.1 POWER.A
N$7
  Top 0.305: LED18.C 115.67,34.06 115.67,16.46 106.17,6.96 LED19.A
N$8
  Top 0.305: LED21.A 31.27,15.29 32.87,13.69 32.87,7.01 36.83,3.05 54.89,3.05 59.08,7.24 LED20.C
N$9
  Top 0.305: LED16.C 65.06,45.38 LED17.A
N$10
  Top 0.305: LED14.C 5.9,43.44 LED15.A
N$11
  Top 0.406: LED12.C 109.6,61.44 113.84,57.2 113.84,49.58 LED13.A
N$12
  Top 0.305: LED11.A 48.71,62.29 LED10.C
N$13
  Top 0.305: LED8.C 24.92,62.03 LED9.A
N$14
  Top 0.305: LED6.C 103.05,82.85 LED7.A
N$15
  Top 0.305: LED4.C LED5.A
N$16
  Top 0.305: LED2.C 7.39,82.73 LED3.A
N$17
  Top 0.305: R3.1 TM1.A
N$18  (via drill 0.5 pad 0.25)
  Top 0.305: 8.89,73.2 8.89,68 LED8.A 3.68,62.79 3.68,48.03 LED14.A | LED2.A 8.89,74.88 8.89,73.2 | 91.08,72.57 LED12.A 92.61,59.92 103.81,59.92 106.32,57.4 106.32,38.99 111.2,34.11 LED18.A 114.91,36.25 117.32,36.25 117.32,14.21 TM1.S | 91.08,72.57 91.08,82.04 LED6.A | 43.82,72.85 LED4.A 43.82,75.59 46.74,72.67 90.98,72.67 91.08,72.57 | 43.82,72.85 43.82,63.16 LED10.A 44.68,62.3 v44.68,58.78 | 8.89,73.2 9.04,73.05 43.61,73.05 43.82,72.85 | 63.45,28.83 63.45,36.17 56.25,43.37 LED16.A 44.66,51.9 v44.68,51.92 | 63.45,28.83 63.45,15.82 LED20.A | R8.2 8.61,22.63 14.88,28.91 63.37,28.91 63.45,28.83
  Bottom 0.305: v44.68,51.92 v44.68,58.78
N$19
  Top 0.305: R3.2 JP2.2
N$20
  Bottom 0.305: R4.1 ACTIVITY.A
N$26
  Bottom 0.305: 98.27,35.03 99.67,35.03
N$27
  Bottom 0.305: 98.27,34.26 99.67,34.26
N$28
  Bottom 0.305: 98.27,33.38 98.4,33.38 99.42,33.38
N$29
  Bottom 0.305: 98.15,43.03 99.54,43.03
N$30
  Bottom 0.305: 98.4,42.27 99.54,42.27
N$31
  Bottom 0.305: 98.4,41.5 99.54,41.5
N$32
  Bottom 0.305: 98.4,40.61 99.54,40.61
N$33
  Bottom 0.305: 98.4,39.73 99.54,39.73
N$34
  Bottom 0.305: 98.27,38.96 99.54,38.96
N$35
  Bottom 0.305: 98.53,38.2 99.54,38.2
N$36
  Bottom 0.305: 98.4,37.44 99.54,37.44
N$37
  Bottom 0.305: 98.4,36.68 99.67,36.68
N$38
  Bottom 0.305: 98.4,35.79 99.67,35.79
RCL  (via drill 0.5 pad 0.25)
  Top 0.305: RCL.3 75.9,65.2 88.93,52.17 88.93,52.12 89.03,52.02 89.03,42.82 v89,42.8
  Bottom 0.305: v89,42.8 89,46.28 89.03,46.3 89.03,44.89 IC1.55
RESET
  Bottom 0.305: IC1.30 85.8,18.7 87.5,17.04 87.63,16.92 96.67,16.92 97.54,16.05 97.54,11.1 76.96,11.1 S1.3
RIGHT
  Bottom 0.305: IC1.28 87.4,18.93 88.42,17.91 97.18,17.91 99.26,15.82 99.26,5.36 96.95,3.05 61.52,3.05 51.54,13.03 U$1.RIGHT
STP_DN
  Bottom 0.305: IC1.43 80.42,39.06 76.58,42.9 14.4,42.9 14.38,42.88 13.39,42.88 10.95,40.44 10.95,13.06 STP_DN.4
STP_UP
  Bottom 0.305: STP_UP.4 11.71,24.64 11.71,40.13 13.79,42.21 76.3,42.21 80.26,38.26 IC1.42
UP
  Bottom 0.305: U$1.UP 30.1,27.05 21.97,27.05 17.73,31.29 17.73,33.17 19.94,35.38 78.99,35.38 80.27,36.66 IC1.40
WX
  Bottom 0.305: WX.4 112.57,63.32 112.57,38.84 112.57,37.19 112.57,36.7 108.31,32.44 103.73,32.44 99.42,28.12 95.43,28.12 95.43,29.23 IC1.18